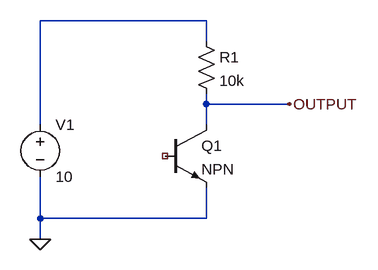
[diagram p0: schematic voltage-divider-with-npn.asc]
voltage-divider-with-npn.asc, the LTspice schematic file:
Version 4
SHEET 1 880 680
WIRE 272 -16 16 -16
WIRE 272 16 272 -16
WIRE 272 112 272 96
WIRE 400 112 272 112
WIRE 16 144 16 -16
WIRE 272 144 272 112
WIRE 16 288 16 224
WIRE 272 288 272 240
WIRE 272 288 16 288
WIRE 16 320 16 288
FLAG 400 112 OUTPUT
FLAG 16 320 0
SYMBOL voltage 16 128 R0
WINDOW 123 0 0 Left 2
WINDOW 39 0 0 Left 2
SYMATTR InstName V1
SYMATTR Value 10
SYMBOL npn 208 144 R0
SYMATTR InstName Q1
SYMBOL res 256 0 R0
SYMATTR InstName R1
SYMATTR Value 10k

The netlist it stands for:
* voltage-divider-with-npn.asc
V1 N001 0 10
Q1 OUTPUT NC_01 0 0 NPN
R1 N001 OUTPUT 10k
.model NPN NPN
.model PNP PNP
.lib standard.bjt
.backanno
.end